# Altium schematic sheet Sensor current 100A.SchDoc: Hall-Sensor, 100A Max.
size A4; Organization: Altium Limited; Address1: 3 Minna Close; Address2: Belrose; Address3: NSW 2085; Address4: Australia
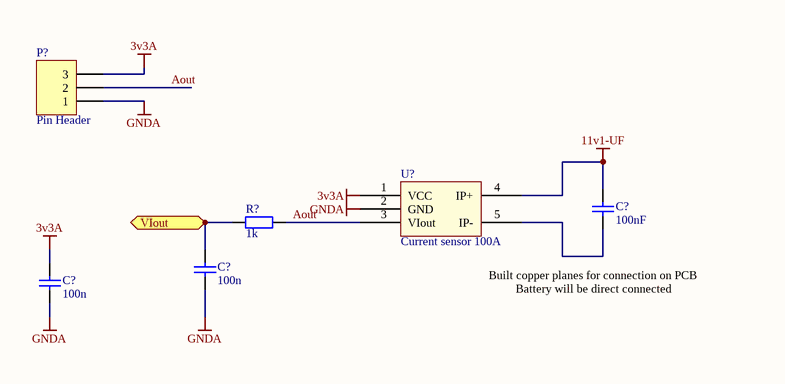
[diagram p0: Sensor current 100A.SchDoc]

## Parts
(Parts that share a designator on the sheet are numbered #1, #2 ... from top to bottom, then left to right.)
C?#1  100nF  [C1206]
C?#2  100n  [C0805]
C?#3  100n  [C0805]
P?  Pin Header  [PH1x3_2.54]
R?  value 1k  [R0805]  (hidden comment: RESISTOR)
U?  Current sensor 100A  [unique-ACS758xCB]

## Ports
VIout (out)

## Nets
3v3A: C?#3.2 P?.3 U?.1(VCC)
11v1-UF: C?#1.2 U?.4(IP+)
GNDA: C?#2.1 C?#3.1 P?.1 U?.2(GND)
Aout: P?.2 R?.1 U?.3(VIout)
VIout: C?#2.2 R?.2 ; port VIout
NetC?#1_1: C?#1.1 U?.5(IP-)

## Notes on the sheet
- Built copper planes for connection on PCB
- Battery will be direct connected
- Disclaimer
  Any design and information, hardware or software  is provided on an "as-is" basis without warranty of any kind and any express or implied warranties, including, but not limited to, the implied warranties of merchantability and fitness for a particular purpose are disclaimed. In no event shall wnpd (or KeaDrone)be liable for any direct, indirect, incidental, special, exemplary, or consequential damages (including, but not limited to, procurement of substitute goods or services; loss of use, data, or profits; or business interruption) however caused and on any theory of liability, whether in contract, strict liability, or tort (including negligence or otherwise) arising in any way out of the use of this firmware, hardware, software or information, even if wnpd (or KeaDrone) has been advised by user of the possibility of such potential loss or damage. The user agrees to hold wnpd (or KeaDrone) harmless from and against any and all claims, losses, liabilities and expenses.
- Title
- Size:
- Date:
- A4
- Name:
- Time:
- Ing. W. Pietersz
- Revision:
- Sheet
- of
- WillyPietersz@gmail.com
- Contact:
- -
- www.wnpd.nl
- File:

## Library data of the parts
C?#1 = 0.1uF: Part Number: 0.1uF; Value: 0.1uF; Voltage: 50V; Type: Ceramic; Tolerance: 0.1; LatestRevision Note: Initial Release; Package: 1206; Component Type: Standard; LatestRevision Date: 14-9-2010; Author: Willem Pietersz; Supplier 2: Farnell; Supplier Part Number 2: 1759361; ComponentLink1Description: Manufacturer; ComponentLink2Description: Datasheet
C?#2 C?#3 = 100n: Tolerance: 0.1; LatestRevision Note: Initial Release; Part Number: 100n; Value: 100n; Package: 0805; Component Type: Standard; LatestRevision Date: 31-7-2010; Author: Willy Pietersz; Supplier 2: Farnell; Supplier Part Number 2: 1759266; ComponentLink1Description: Manufacturer; ComponentLink2Description: Datasheet
P? = PH1x3: Con1x3; Part Number: PH1x3; Pitch: 2.54; LatestRevision Note: Initial Release; Type: Pin Header; Number Of Pins: 3; Component Type: Standard; LatestRevision Date: 23-11-2010; Author: Willy Pietersz; Supplier 2: Farnell
R? = 1K: Manufacturer 1: Panasonic; Manufacturer 1 Part No: ERJT06J102V; Power: 0.25W; Tolerance: 0.05; LatestRevision Note: Initial Release; Published: 8-Jun-2000; LatestRevisionDate: 17-Jul-2002; LatestRevisionNote: Re-released for DXP Platform.; PackageReference: AXIAL-0.4; Publisher: Altium Limited; Part Number: 1K; Type: Film; Package: 0805; Component Type: Standard; LatestRevision Date: 30-7-2010; Author: Willy Pietersz; ROHS: Y; Supplier 2: Farnell; Supplier Part Number 2: 1618241; ComponentLink1Description: Manufacturer; ComponentLink2Description: Datasheet
U? = ACS758xCB: Sensor, Current; Part Number: ACS758xCB; Component Type: Sensor; Supplier 1: Digikey; Supplier Part Number 1: 620-1321-ND; Supplier 2: Farnell; Supplier Part Number 2: 1791393; ComponentLink1Description: Datasheet; ComponentLink1URL: http://www.allegromicro.com/en/Products/Part_Numbers/0758/0758.pdf